# Altium schematic sheet HT66FM5440_EVB.SchDoc
size 330 x 219 mm; PageSetup: Record=PageOptions|CenterHorizontal=True|CenterVertical=True|PrintScale=0.89|XCorrection=1.00|YCorrection=1.00|PrintKind=0|BorderSize=5000000|LeftOffset=0|BottomOffset=0|Orientation=2|PaperLength=1000|PaperWidth=1000|Scale=100|PaperSource=7|PrintQuality=-3|MediaType=1|DitherType=10|PaperKind=A4|PrintScaleMode=1
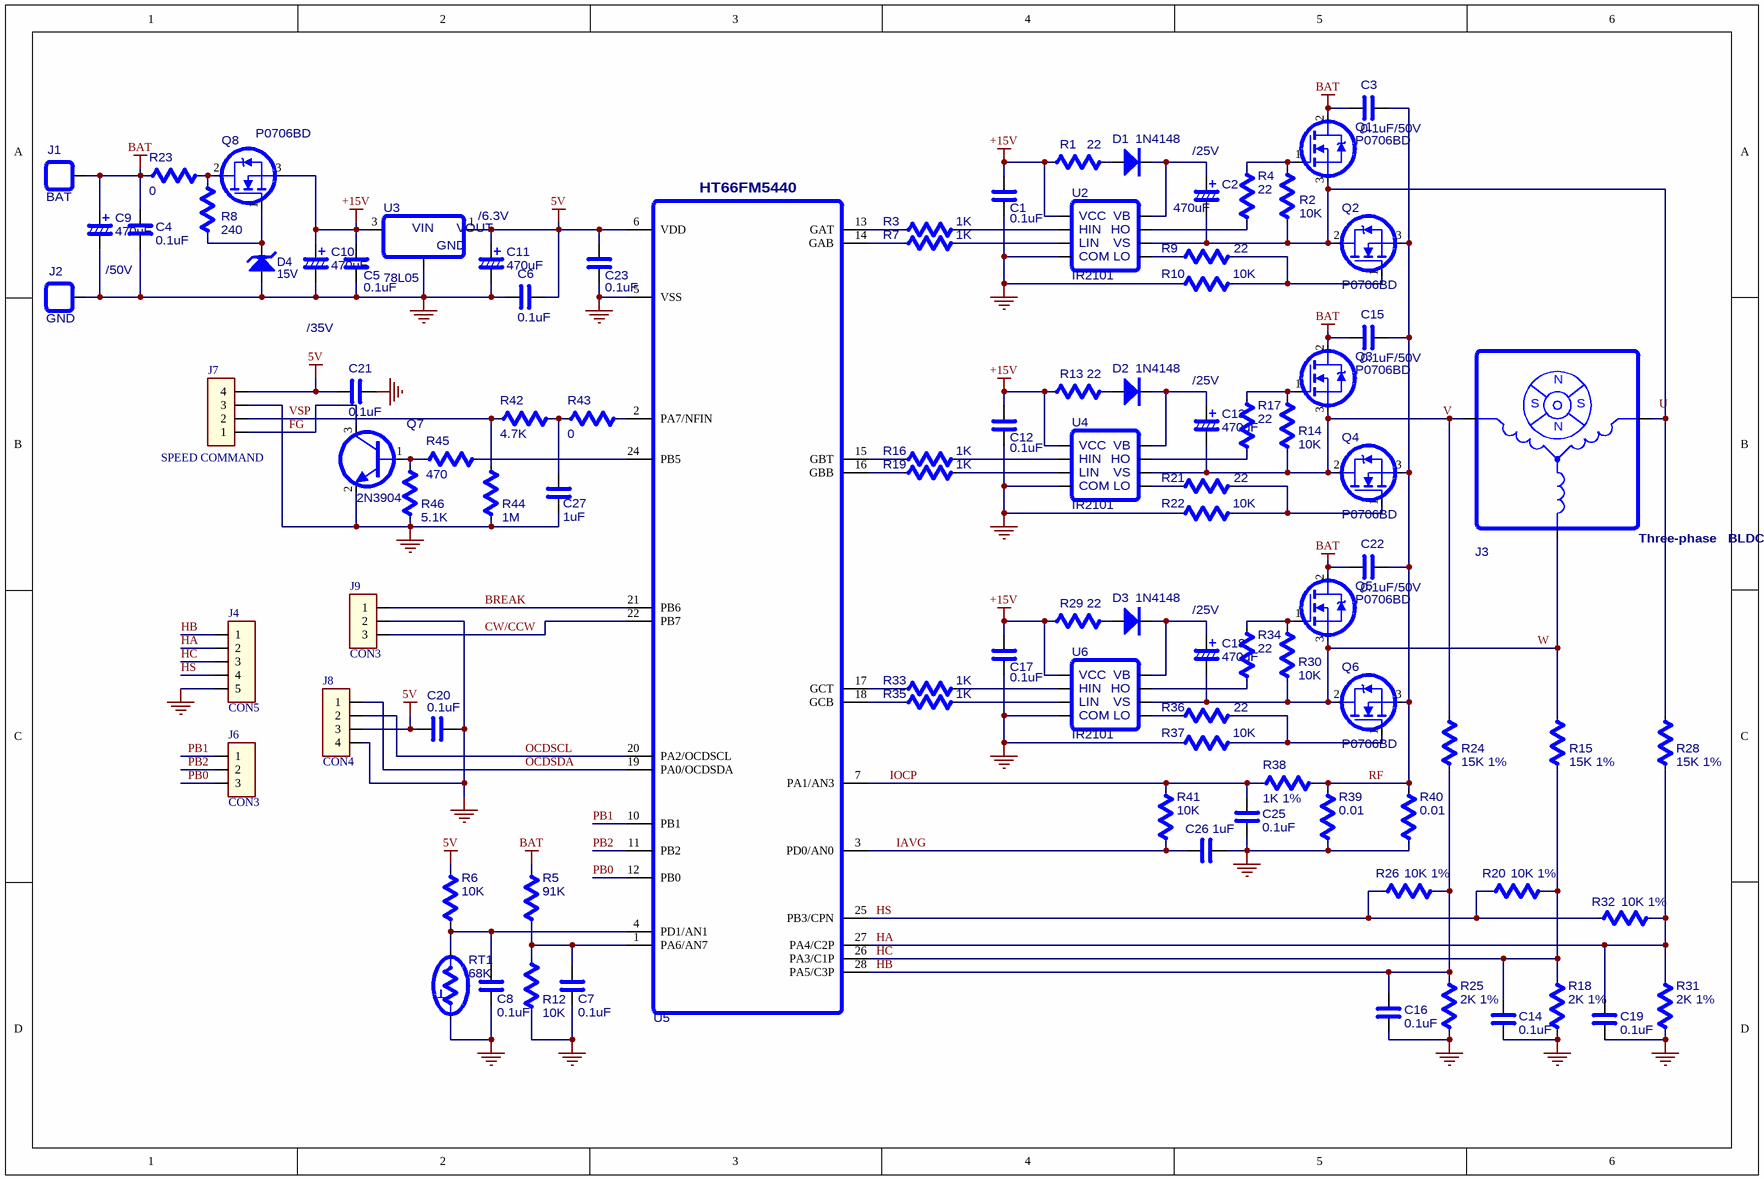
[diagram p0: HT66FM5440_EVB.SchDoc]

## Parts
C1  0.1uF
C2  470uF  [0805C]
C3  0.1uF/50V
C4  0.1uF
C5  0.1uF
C6  0.1uF
C7  0.1uF
C8  0.1uF
C9  470uF  [CD-10.5*21]
C10  470uF  [ECAP 35V47UF]
C11  470uF  [ECAP 35V47UF]
C12  0.1uF
C13  470uF  [0805C]
C14  0.1uF  [0603C]
C15  0.1uF/50V
C16  0.1uF  [0603C]
C17  0.1uF
C18  470uF  [0805C]
C19  0.1uF  [0603C]
C20  0.1uF  [0603c]
C21  0.1uF  [0603c]
C22  0.1uF/50V
C23  0.1uF
C25  0.1uF
C26  1uF
C27  1uF
D1  1N4148  [1206D]
D2  1N4148  [1206D]
D3  1N4148  [1206D]
D4  15V  [1206D]
J1  BAT  [SIP1-big]
J2  GND  [SIP1-big]
J3  BLDC motor(1)  (value not drawn)
J4  CON5
J6  CON3
J7  SPEED COMMAND  [HDR1X4]
J8  CON4  [SIP4]
J9  CON3  [SIP3-2.54mm]
Q1  P0706BD  [TO252]
Q2  P0706BD  [TO252]
Q3  P0706BD  [TO252]
Q4  P0706BD  [TO252]
Q5  P0706BD  [TO252]
Q6  P0706BD  [TO252]
Q7  2N3904  [SOT-23]
Q8  P0706BD  [TO252]
R1  22
R2  10K
R3  1K
R4  22
R5  91K
R6  10K
R7  1K
R8  240
R9  22
R10  10K
R12  10K
R13  22
R14  10K
R15  15K 1%
R16  1K
R17  22
R18  2K 1%
R19  1K
R20  10K 1%
R21  22
R22  10K
R23  0
R24  15K 1%
R25  2K 1%
R26  10K 1%
R28  15K 1%
R29  22
R30  10K
R31  2K 1%
R32  10K 1%
R33  1K
R34  22
R35  1K
R36  22
R37  10K
R38  1K 1%
R39  0.01
R40  0.01
R41  10K
R42  4.7K
R43  0
R44  1M
R45  470
R46  5.1K
RT1  68K
U2  IR2101  [SOP-8]
U3  78L05  [SOT-89]
U4  IR2101  [SOP-8]
U5  HT66FM5440/28SSOP  [SSOP28]  (value not drawn)
U6  IR2101  [SOP-8]

## Nets
5V: C6.2 C11.1 C20.1 C21.2 C23.1 J7.4 J8.3 R6.2 U3.1(Vout) U5.6(VDD)
+15V: C1.2 C5.2 C10.1 C12.2 C17.2 Q8.3 R1.1 R13.1 R29.1 U2.1(VCC) U3.3(Vin) U4.1(VCC) U6.1(VCC)
BAT: C3.1 C4.1 C9.1 C15.1 C22.1 J1.1 Q1.2(D) Q3.2(D) Q5.2(D) R5.2 R23.1
GND: C1.1 C4.2 C5.1 C6.1 C7.1 C8.1 C9.2 C10.2 C11.2 C12.1 C14.2 C16.2 C17.1 C19.2 C20.2 C21.1 C23.2 C25.1 C26.1 C27.1 D4.1(A) J2.1 J4.5 J7.3 J8.4 J9.2 Q7.2(E) R10.2 R12.1 R18.1 R22.2 R25.1 R31.1 R37.2 R39.1 R40.1 R44.1 R46.1 RT1.1 U2.4(COM) U3.2(GND) U4.4(COM) U5.5(VSS) U6.4(COM)
BREAK: J9.1 U5.21(PB6)
CW/CCW: J9.3 U5.22(PB7)
FG: J7.1 Q7.3(C)
HA: C19.1 J4.2 R28.2 R31.2 R32.2 U5.27(PA4/C2P)
HB: C16.1 J4.1 R24.2 R25.2 R26.2 U5.28(PA5/C3P)
HC: C14.1 J4.3 R15.2 R18.2 R20.2 U5.26(PA3/C1P)
HS: J4.4 R20.1 R26.1 R32.1 U5.25(PB3/CPN)
IAVG: C26.2 R41.1 U5.3(PD0/AN0)
IOCP: C25.2 R38.1 R41.2 U5.7(PA1/AN3)
OCDSCL: J8.2 U5.20(PA2/OCDSCL)
OCDSDA: J8.1 U5.19(PA0/OCDSDA)
PB0: J6.3 U5.12(PB0)
PB1: J6.1 U5.10(PB1)
PB2: J6.2 U5.11(PB2)
RF: C3.2 C15.2 C22.2 Q2.3 Q4.3 Q6.3 R38.2 R39.2 R40.2
V: C13.2 J3.2 Q3.3 Q4.2(D) R14.1 R24.1 U4.6(VS)
VSP: J7.2 R42.1 R44.2
W: C18.2 J3.3 Q5.3 Q6.2(D) R15.1 R30.1 U6.6(VS)
NetC2_1: C2.1 D1.2(K) U2.8(VB)
NetC2_2: C2.2 J3.1 Q1.3 Q2.2(D) R2.1 R28.1 U2.6(VS)
NetC7_2: C7.2 R5.1 R12.2 U5.1(PA6/AN7)
NetC8_2: C8.2 R6.1 RT1.2 U5.4(PD1/AN1)
NetC13_1: C13.1 D2.2(K) U4.8(VB)
NetC18_1: C18.1 D3.2(K) U6.8(VB)
NetC27_2: C27.2 R42.2 R43.1
NetD1_1: D1.1(A) R1.2
NetD2_1: D2.1(A) R13.2
NetD3_1: D3.1(A) R29.2
NetD4_2: D4.2(K) Q8.1(G) R8.1
NetQ1_1: Q1.1(G) R2.2 R4.1
NetQ2_1: Q2.1(G) R9.2 R10.1
NetQ3_1: Q3.1(G) R14.2 R17.1
NetQ4_1: Q4.1(G) R21.2 R22.1
NetQ5_1: Q5.1(G) R30.2 R34.1
NetQ6_1: Q6.1(G) R36.2 R37.1
NetQ7_1: Q7.1(B) R45.1 R46.2
NetQ8_2: Q8.2(D) R8.2 R23.2
NetR3_1: R3.1 U5.13(GAT)
NetR3_2: R3.2 U2.2(HIN)
NetR4_2: R4.2 U2.7(HO)
NetR7_1: R7.1 U5.14(GAB)
NetR7_2: R7.2 U2.3(LIN)
NetR9_1: R9.1 U2.5(LO)
NetR16_1: R16.1 U5.15(GBT)
NetR16_2: R16.2 U4.2(HIN)
NetR17_2: R17.2 U4.7(HO)
NetR19_1: R19.1 U5.16(GBB)
NetR19_2: R19.2 U4.3(LIN)
NetR21_1: R21.1 U4.5(LO)
NetR33_1: R33.1 U5.17(GCT)
NetR33_2: R33.2 U6.2(HIN)
NetR34_2: R34.2 U6.7(HO)
NetR35_1: R35.1 U5.18(GCB)
NetR35_2: R35.2 U6.3(LIN)
NetR36_1: R36.1 U6.5(LO)
NetR43_2: R43.2 U5.2(PA7/NFIN)
NetR45_2: R45.2 U5.24(PB5)

## Notes on the sheet
- /25V
- (near U3) /6.3V
- (near U5) HT66FM5440
- /50V
- /35V
- Labels drawn without touching a wire or pin: U
- (in symbol 78L05_1) VIN; VOUT
- (in symbol BLDC motor(1)_1) N; S; Three-phase   BLDC motor
- (in symbol Sensor(1)) T

## Library data of the parts
C1 C3-C8 C12 C14-C17 C19-C23 C25-C27 = Cap(1): Capacitor; Published: 8-Jun-2000; LatestRevisionDate: 17-Jul-2002; LatestRevisionNote: Re-released for DXP Platform.; PackageReference: RAD-0.3; Publisher: Altium Limited; Size: Small; Update: 2016/12/29
  C1 C4-C8 C12 C14 C16 C17 C19-C21 C23 C25: Value: 0.1uF
  C3 C15 C22: Value: 0.1uF/50V
  C26 C27: Value: 1uF
C2 C9-C11 C13 C18 = Cap(2): Capacitor; Value: 470uF; Update: 2016/12/29; Size: Small
D1-D3 = Diode(1): Diode; Published: 8-Jun-2000; LatestRevisionDate: 17-Jul-2002; LatestRevisionNote: Re-released for DXP Platform.; PackageVersion: Sep-1996; PackageReference: SMC; Publisher: Altium Limited; PackageDescription: DO-214-AB/SMC; 2 C-Bend Leads; Body 7.9 x 5.9 mm, inc. leads (LxW); Code_JEDEC: DO-214-AB; Value: 1N4148; Update: 2016/12/29; Size: Small
D4 = Zener(1): Zener Diode; Value: 15V; Update: *; Size: Small
J1 J2 = CON1: LatestRevisionDate: 17-Jul-2002; LatestRevisionNote: Re-released for DXP Platform.; Publisher: Altium Limited
J3 = BLDC motor(1)_1
J7 = CON4
Q1-Q6 Q8 = NMOS(4): N-Channel Power MOSFET; Note: Pin 2 is electrically connected to pin 4.; Published: 8-Jun-2000; LatestRevisionDate: 17-Jul-2002; LatestRevisionNote: Re-released for DXP Platform.; DatasheetVersion: PD-9.814; PackageVersion: Feb-1997; PackageReference: TO-220AB; Publisher: Altium Limited; PackageDescription: TO, Thru-Hole, Vertical, Heatsink Mounted; 3 In-Line Leads; Pitch 2.54 mm; ComponentLink1Description: Manufacturer Link; ComponentLink1URL: http://www.irf.com/
Q7 = NPN(2): NPN Bipolar Transistor; Published: 8-Jun-2000; LatestRevisionDate: 17-Jul-2002; LatestRevisionNote: Re-released for DXP Platform.; PackageReference: TO-226-AA; Publisher: Altium Limited; PackageDescription: TO, Flat Index; 3 In-Line, Axial Leads; Body Dia. 4.8mm; Leads 0.55 x 0.51 mm (max); Code_JEDEC: TO-226-AA
R1-R10 R12-R26 R28-R46 = Resistor(1)_1: Resisitor; Size: Midium; Update: 2016/12/29
  R1 R4 R9 R13 R17 R21 R29 R34 R36: Value: 22
  R2 R6 R10 R12 R14 R22 R30 R37 R41: Value: 10K
  R3 R7 R16 R19 R33 R35: Value: 1K
  R5: Value: 91K
  R8: Value: 240
  R15 R24 R28: Value: 15K 1%
  R18 R25 R31: Value: 2K 1%
  R20 R26 R32: Value: 10K 1%
  R23 R43: Value: 0
  R38: Value: 1K 1%
  R39 R40: Value: 0.01
  R42: Value: 4.7K
  R44: Value: 1M
  R45: Value: 470
  R46: Value: 5.1K
RT1 = Sensor(1)
U2 U4 U6 = IR2101/SOP-8
U3 = 78L05_1